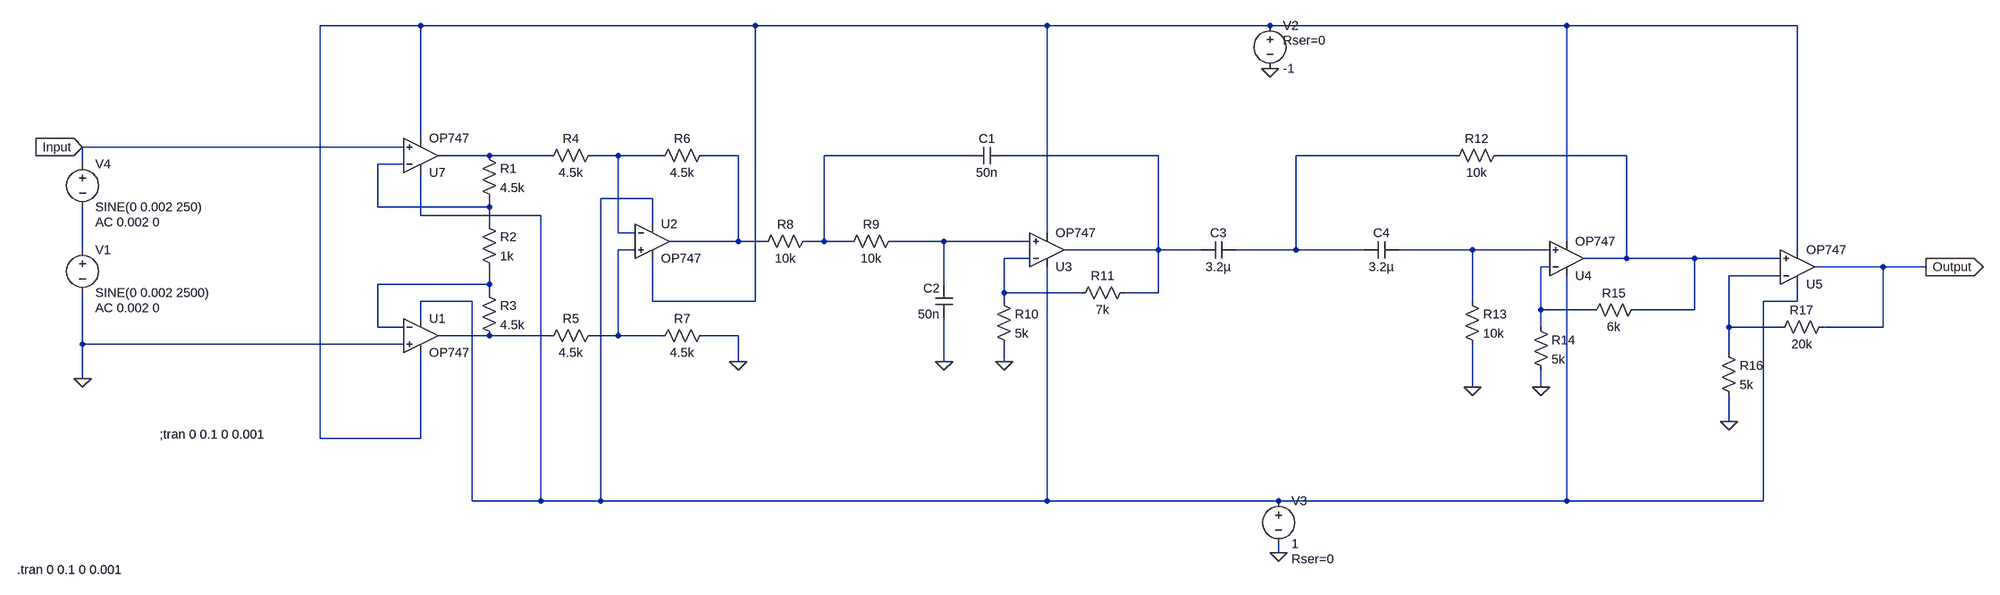
[diagram p0: schematic Circuit.asc]
Circuit.asc, the LTspice schematic file:
Version 4
SHEET 1 3020 932
WIRE 64 -560 -192 -560
WIRE 688 -560 64 -560
WIRE 1232 -560 688 -560
WIRE 1648 -560 1232 -560
WIRE 2208 -560 1648 -560
WIRE 2640 -560 2208 -560
WIRE 64 64 64 -560
WIRE 32 80 -640 80
WIRE 192 96 96 96
WIRE 304 96 192 96
WIRE 432 96 384 96
WIRE 512 96 432 96
WIRE 656 96 592 96
WIRE 1088 96 816 96
WIRE 1440 96 1152 96
WIRE 2000 96 1696 96
WIRE 2320 96 2080 96
WIRE -640 112 -640 80
WIRE 32 112 -16 112
WIRE 496 176 400 176
WIRE -16 192 -16 112
WIRE 192 192 192 176
WIRE 192 192 -16 192
WIRE 64 208 64 128
WIRE 288 208 64 208
WIRE 192 224 192 192
WIRE 496 224 496 176
WIRE 432 240 432 96
WIRE 464 240 432 240
WIRE 1232 240 1232 -560
WIRE 656 256 656 96
WIRE 656 256 528 256
WIRE 704 256 656 256
WIRE 816 256 816 96
WIRE 816 256 784 256
WIRE 864 256 816 256
WIRE 1040 256 944 256
WIRE 1200 256 1040 256
WIRE 2208 256 2208 -560
WIRE -640 272 -640 192
WIRE 464 272 432 272
WIRE 1440 272 1440 96
WIRE 1440 272 1264 272
WIRE 1520 272 1440 272
WIRE 1696 272 1696 96
WIRE 1696 272 1584 272
WIRE 1824 272 1696 272
WIRE 2032 272 1888 272
WIRE 2176 272 2032 272
WIRE 2640 272 2640 -560
WIRE 1200 288 1152 288
WIRE 2320 288 2320 96
WIRE 2320 288 2240 288
WIRE 2448 288 2320 288
WIRE 2608 288 2448 288
WIRE 2176 304 2160 304
WIRE 2800 304 2672 304
WIRE 2880 304 2800 304
WIRE 2608 320 2512 320
WIRE 192 336 192 304
WIRE 192 336 -16 336
WIRE 1040 336 1040 256
WIRE 192 352 192 336
WIRE 1152 352 1152 288
WIRE 1296 352 1152 352
WIRE 1440 352 1440 272
WIRE 1440 352 1376 352
WIRE 160 368 64 368
WIRE 496 368 496 288
WIRE 688 368 688 -560
WIRE 688 368 496 368
WIRE 1152 368 1152 352
WIRE 2032 368 2032 272
WIRE 2640 368 2640 336
WIRE 2640 368 2576 368
WIRE 2160 384 2160 304
WIRE 2256 384 2160 384
WIRE 2448 384 2448 288
WIRE 2448 384 2336 384
WIRE 64 400 64 368
WIRE -16 416 -16 336
WIRE 32 416 -16 416
WIRE 2160 416 2160 384
WIRE 2512 416 2512 320
WIRE 2608 416 2512 416
WIRE 2800 416 2800 304
WIRE 2800 416 2688 416
WIRE 192 432 96 432
WIRE 304 432 192 432
WIRE 432 432 432 272
WIRE 432 432 384 432
WIRE 512 432 432 432
WIRE 656 432 592 432
WIRE -640 448 -640 352
WIRE 32 448 -640 448
WIRE 2512 464 2512 416
WIRE 656 480 656 432
WIRE 1040 480 1040 400
WIRE 1152 480 1152 448
WIRE -640 512 -640 448
WIRE 2032 528 2032 448
WIRE 2160 528 2160 496
WIRE 2512 592 2512 544
WIRE -192 624 -192 -560
WIRE 64 624 64 464
WIRE 64 624 -192 624
WIRE 160 784 160 368
WIRE 288 784 288 208
WIRE 288 784 160 784
WIRE 400 784 400 176
WIRE 400 784 288 784
WIRE 1232 784 1232 304
WIRE 1232 784 400 784
WIRE 1664 784 1232 784
WIRE 2208 784 2208 320
WIRE 2208 784 1664 784
WIRE 2576 784 2576 368
WIRE 2576 784 2208 784
WIRE 1664 880 1664 864
FLAG 656 480 0
FLAG 1040 480 0
FLAG 1152 480 0
FLAG 2032 528 0
FLAG 2160 528 0
FLAG 2512 592 0
FLAG 2880 304 Output
IOPIN 2880 304 Out
FLAG -640 512 0
FLAG -640 80 Input
IOPIN -640 80 In
FLAG 1664 880 0
FLAG 1648 -480 0
SYMBOL res 176 80 R0
SYMATTR InstName R1
SYMATTR Value 4.5k
SYMBOL res 176 208 R0
SYMATTR InstName R2
SYMATTR Value 1k
SYMBOL res 176 336 R0
SYMATTR InstName R3
SYMATTR Value 4.5k
SYMBOL res 400 80 R90
WINDOW 0 0 56 VBottom 2
WINDOW 3 32 56 VTop 2
SYMATTR InstName R4
SYMATTR Value 4.5k
SYMBOL res 400 416 R90
WINDOW 0 0 56 VBottom 2
WINDOW 3 32 56 VTop 2
SYMATTR InstName R5
SYMATTR Value 4.5k
SYMBOL res 608 80 R90
WINDOW 0 0 56 VBottom 2
WINDOW 3 32 56 VTop 2
SYMATTR InstName R6
SYMATTR Value 4.5k
SYMBOL res 608 416 R90
WINDOW 0 0 56 VBottom 2
WINDOW 3 32 56 VTop 2
SYMATTR InstName R7
SYMATTR Value 4.5k
SYMBOL res 800 240 R90
WINDOW 0 0 56 VBottom 2
WINDOW 3 32 56 VTop 2
SYMATTR InstName R8
SYMATTR Value 10k
SYMBOL res 960 240 R90
WINDOW 0 0 56 VBottom 2
WINDOW 3 32 56 VTop 2
SYMATTR InstName R9
SYMATTR Value 10k
SYMBOL cap 1152 80 R90
WINDOW 0 0 32 VBottom 2
WINDOW 3 32 32 VTop 2
SYMATTR InstName C1
SYMATTR Value 50n
SYMBOL res 1136 352 R0
SYMATTR InstName R10
SYMATTR Value 5k
SYMBOL cap 1056 400 R180
WINDOW 0 24 56 Left 2
WINDOW 3 24 8 Left 2
SYMATTR InstName C2
SYMATTR Value 50n
SYMBOL res 1392 336 R90
WINDOW 0 0 56 VBottom 2
WINDOW 3 32 56 VTop 2
SYMATTR InstName R11
SYMATTR Value 7k
SYMBOL cap 1584 256 R90
WINDOW 0 0 32 VBottom 2
WINDOW 3 32 32 VTop 2
SYMATTR InstName C3
SYMATTR Value 3.2µ
SYMBOL cap 1888 256 R90
WINDOW 0 0 32 VBottom 2
WINDOW 3 32 32 VTop 2
SYMATTR InstName C4
SYMATTR Value 3.2µ
SYMBOL res 2096 80 R90
WINDOW 0 0 56 VBottom 2
WINDOW 3 32 56 VTop 2
SYMATTR InstName R12
SYMATTR Value 10k
SYMBOL res 2016 352 R0
SYMATTR InstName R13
SYMATTR Value 10k
SYMBOL res 2144 400 R0
SYMATTR InstName R14
SYMATTR Value 5k
SYMBOL res 2352 368 R90
WINDOW 0 0 56 VBottom 2
WINDOW 3 32 56 VTop 2
SYMATTR InstName R15
SYMATTR Value 6k
SYMBOL res 2496 448 R0
SYMATTR InstName R16
SYMATTR Value 5k
SYMBOL res 2704 400 R90
WINDOW 0 0 56 VBottom 2
WINDOW 3 32 56 VTop 2
SYMATTR InstName R17
SYMATTR Value 20k
SYMBOL voltage -640 256 R0
WINDOW 123 24 124 Left 2
WINDOW 39 0 0 Left 0
SYMATTR Value2 AC 0.002 0
SYMATTR InstName V1
SYMATTR Value SINE(0 0.002 2500)
SYMBOL OpAmps\\OP747 64 160 M180
SYMATTR InstName U7
SYMBOL OpAmps\\OP747 64 368 R0
SYMATTR InstName U1
SYMBOL OpAmps\\OP747 496 192 R0
SYMATTR InstName U2
SYMBOL OpAmps\\OP747 1232 336 M180
SYMATTR InstName U3
SYMBOL OpAmps\\OP747 2208 352 M180
SYMATTR InstName U4
SYMBOL OpAmps\\OP747 2640 368 M180
SYMATTR InstName U5
SYMBOL voltage 1648 -576 R0
WINDOW 123 0 0 Left 0
WINDOW 39 24 44 Left 2
SYMATTR SpiceLine Rser=0
SYMATTR InstName V2
SYMATTR Value -1
SYMBOL voltage 1664 768 R0
WINDOW 123 0 0 Left 0
WINDOW 39 24 124 Left 2
SYMATTR SpiceLine Rser=0
SYMATTR InstName V3
SYMATTR Value 1
SYMBOL voltage -640 96 R0
WINDOW 123 24 124 Left 2
WINDOW 39 0 0 Left 0
SYMATTR Value2 AC 0.002 0
SYMATTR InstName V4
SYMATTR Value SINE(0 0.002 250)
TEXT -496 616 Left 2 !;tran 0 0.1 0 0.001
TEXT -762 912 Left 2 !.tran 0 0.1 0 0.001

The netlist it stands for:
* Circuit.asc
R1 N002 N009 4.5k
R2 N009 N018 1k
R3 N018 N019 4.5k
R4 N003 N002 4.5k
R5 N013 N019 4.5k
R6 N004 N003 4.5k
R7 0 N013 4.5k
R8 N005 N004 10k
R9 N011 N005 10k
C1 N006 N005 50n
R10 N015 0 5k
C2 0 N011 50n
R11 N006 N015 7k
C3 N007 N006 3.2µ
C4 N014 N007 3.2µ
R12 N008 N007 10k
R13 N014 0 10k
R14 N016 0 5k
R15 N008 N016 6k
R16 N017 0 5k
R17 Output N017 20k
V1 N012 0 SINE(0 0.002 2500) AC 0.002 0
XU7 Input N009 N010 N001 N002 OP747  ; pins In+ In- V+ V- OUT
XU1 0 N018 N010 N001 N019 OP747  ; pins In+ In- V+ V- OUT
XU2 N013 N003 N010 N001 N004 OP747  ; pins In+ In- V+ V- OUT
XU3 N011 N015 N010 N001 N006 OP747  ; pins In+ In- V+ V- OUT
XU4 N014 N016 N010 N001 N008 OP747  ; pins In+ In- V+ V- OUT
XU5 N008 N017 N010 N001 Output OP747  ; pins In+ In- V+ V- OUT
V2 N001 0 -1 Rser=0
V3 N010 0 1 Rser=0
V4 Input N012 SINE(0 0.002 250) AC 0.002 0
;tran 0 0.1 0 0.001
.tran 0 0.1 0 0.001
.backanno
.end